# Altium schematic sheet TK2560_InputKeys.SchDoc
size A4
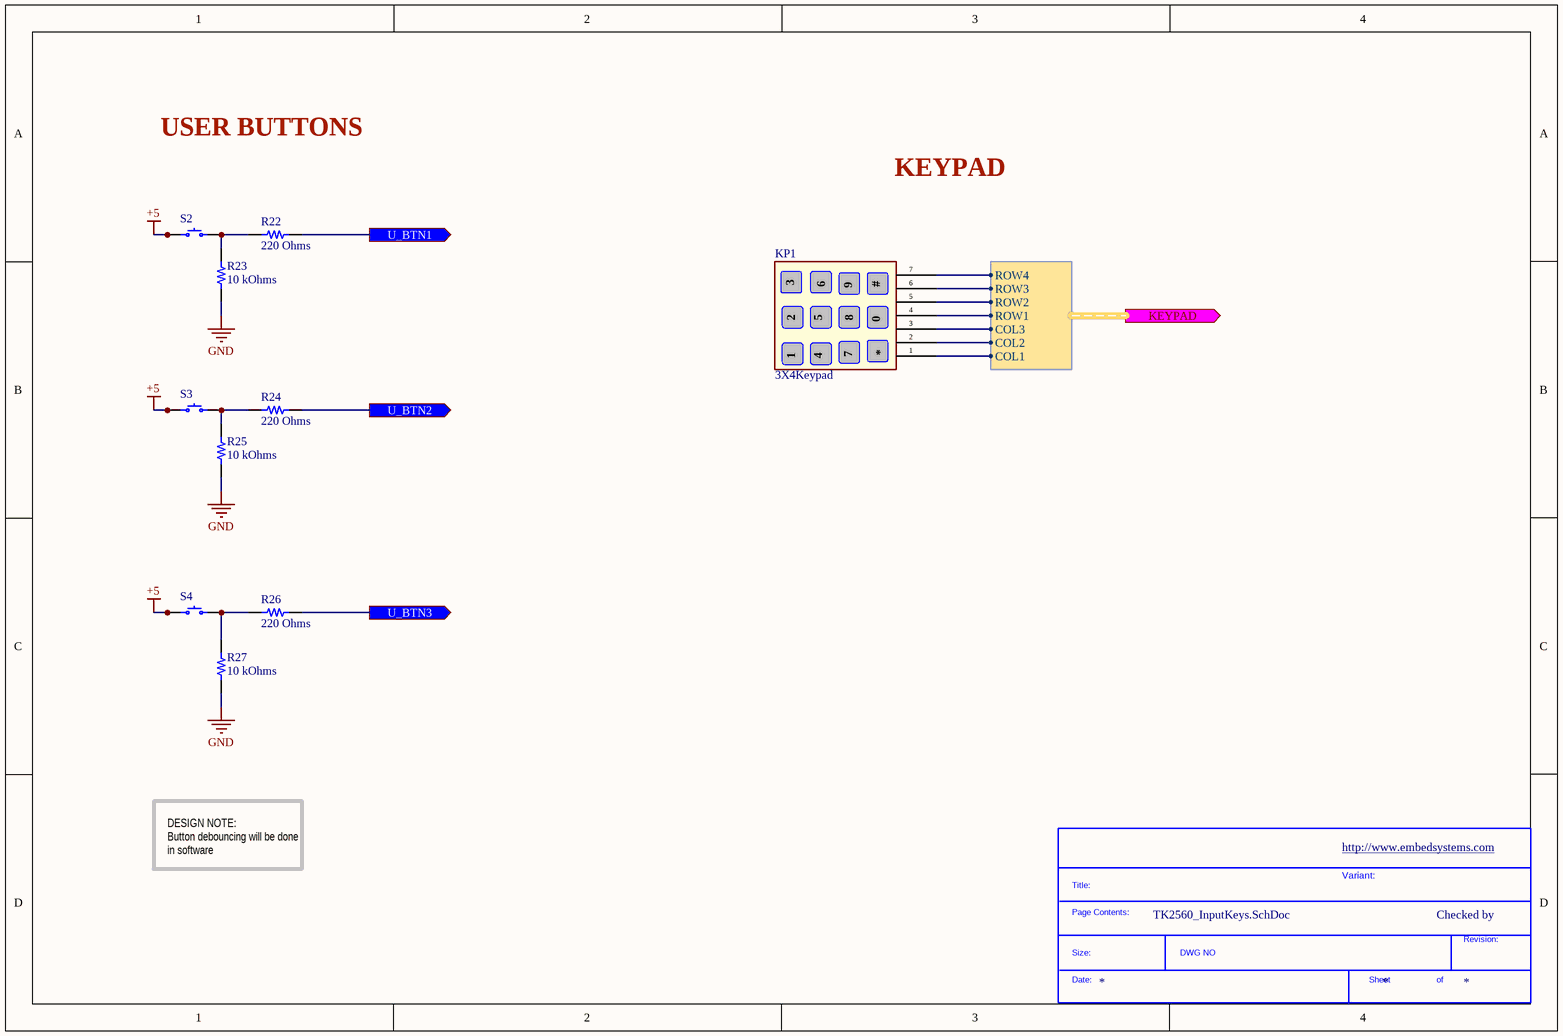
[diagram p0: TK2560_InputKeys.SchDoc]

## Parts
*?  SDTitleBlock  (value not drawn)  (graphical)
KP1  3X4Keypad  [COM-08653]
R22  220 Ohms  [RES 0805_2012]
R23  10 kOhms  [RES 0805_2012]
R24  220 Ohms  [RES 0805_2012]
R25  10 kOhms  [RES 0805_2012]
R26  220 Ohms  [RES 0805_2012]
R27  10 kOhms  [RES 0805_2012]
S2  PTS645SM43SMTR92 LFS  [C&K PTS645]  (value not drawn)
S3  PTS645SM43SMTR92 LFS  [C&K PTS645]  (value not drawn)
S4  PTS645SM43SMTR92 LFS  [C&K PTS645]  (value not drawn)

## Ports
KEYPAD (out, harness KEYPAD), U_BTN1 (out), U_BTN2 (out), U_BTN3 (out)

## Harnesses
KEYPAD: ROW1, ROW2, ROW3, ROW4, COL1, COL2, COL3

## Nets
+5: S2.1 S2.2 S3.1 S3.2 S4.1 S4.2
GND: R23.2 R25.2 R27.2
U_BTN1: R22.2 ; port U_BTN1
U_BTN2: R24.2 ; port U_BTN2
U_BTN3: R26.2 ; port U_BTN3
NetKP1_1: KP1.1 ; port KEYPAD.COL1
NetKP1_2: KP1.2 ; port KEYPAD.COL2
NetKP1_3: KP1.3 ; port KEYPAD.COL3
NetKP1_4: KP1.4 ; port KEYPAD.ROW1
NetKP1_5: KP1.5 ; port KEYPAD.ROW2
NetKP1_6: KP1.6 ; port KEYPAD.ROW3
NetKP1_7: KP1.7 ; port KEYPAD.ROW4
NetR22_1: R22.1 R23.1 S2.3 S2.4
NetR24_1: R24.1 R25.1 S3.3 S3.4
NetR26_1: R26.1 R27.1 S4.3 S4.4

## Notes on the sheet
- USER BUTTONS
- KEYPAD
- DESIGN NOTE:
  Button debouncing will be done in software
- http://www.embedsystems.com
- Variant:
- Checked by
- (in symbol 3X4Keypad) 9; #; 8; 0
- (in symbol SDTitleBlock) Title:; Page Contents:; Revision:; Size:; DWG NO; Date:; Sheet; of

## Library data of the parts
KP1 = 3X4Keypad: 3x4 Matrix Keypad; Manufacturer: Adafruit Industries; Manufacturer Part Number: 3845; Stock 1: 43; Pricing 1: 1=6.50000 (USD); Supplier 1: Digi-Key; Supplier Part Number 1: 1528-2673-ND
R22 R24 R26 = ERJ-6ENF2200V: RES SMD 220 OHM 1% 1/8W 0805; Manufacturer: Panasonic Electronic Components; Power (Watts): 0.125W, 1/8W; Temperature Coefficient: ±100ppm/°C; Part Number: ERJ-6ENF2200V; Value: 220 Ohms; ComponentLink1Description: Datasheet; ComponentLink1URL: https://industrial.panasonic.com/cdbs/www-data/pdf/RDA0000/AOA0000C304.pdf; ComponentLink2Description: DigiKey Link; ComponentLink2URL: http://digikey.com/product-detail/en/panasonic-electronic-components/ERJ-6ENF2200V/P220CCT-ND/1746831; Composition: Thick Film; Device Package: 0805 (2012 Metric); Features: Automotive AEC-Q200; Height - Seated (Max): 0.028" (0.70mm); LastUpdated: 02/09/2020 01:15:19; Lifecycle Status: Active; Minimum Order: 1; Number of Terminations: 2; Operating Temperature: -55°C ~ 155°C; Package / Case: 0805 (2012 Metric); Packaging: TapeAndReel; PartId: 30101; Part Status: Active; Price: 0.01; Ratings: AEC-Q200; Resistance: 220 Ohms; Series: ERJ; Size / Dimension: 0.079" L x 0.049" W (2.00mm x 1.25mm); Supplier 1: DigiKey; Supplier Part Number 1: P220CCT-ND; Supplier Device Package: 0805; Tolerance: ±1%
R23 R25 R27 = CPF0805B10KE: RES SMD 10K OHM 0.1% 1/10W 0805; Manufacturer: TE Connectivity Passive Product; Power (Watts): 0.1W, 1/10W; Temperature Coefficient: ±25ppm/°C; Part Number: CPF0805B10KE; Value: 10 kOhms; ComponentLink1Description: Datasheet; ComponentLink1URL: https://www.te.com/commerce/DocumentDelivery/DDEController?Action=srchrtrv&DocNm=1773200&DocType=DS&DocLang=English; ComponentLink2Description: DigiKey Link; ComponentLink2URL: http://digikey.com/product-detail/en/te-connectivity-passive-product/CPF0805B10KE/A106043CT-ND/3477679; Composition: Thin Film; Device Package: 0805 (2012 Metric); Height - Seated (Max): 0.026" (0.65mm); LastUpdated: 02/09/2020 01:15:24; Lifecycle Status: Active; Minimum Order: 1; Number of Terminations: 2; Operating Temperature: -55°C ~ 155°C; Package / Case: 0805 (2012 Metric); Packaging: TapeAndReel; PartId: 27724; Part Status: Active; Price: 0.09; Resistance: 10 kOhms; Series: CPF, Neohm; Size / Dimension: 0.079" L x 0.049" W (2.00mm x 1.25mm); Supplier 1: DigiKey; Supplier Part Number 1: A106043CT-ND; Supplier Device Package: 0805; Tolerance: ±0.1%
S2-S4 = PTS645SM43SMTR92 LFS: SWITCH TACTILE SPST-NO 0.05A 12V; Manufacturer: C&K; Actuator Height off PCB, Vertical: 4.30mm; Actuator Orientation: Top Actuated; Actuator Type: Standard; Contact Rating @ Voltage: 0.05A @ 12VDC; Illumination: Non-Illuminated; Operating Force: 160gf; Outline: 6.00mm x 6.00mm; Switch Function: Off-Mom; Part Number: PTS645SM43SMTR92 LFS; Circuit: SPST-NO; ComponentLink1Description: Datasheet; ComponentLink1URL: https://dznh3ojzb2azq.cloudfront.net/products/Tactile/PTS645/documents/datasheet.pdf; ComponentLink2Description: DigiKey Link; ComponentLink2URL: http://digikey.com/product-detail/en/c-k/PTS645SM43SMTR92-LFS/CKN9112CT-ND/1146934; Features: Blue Actuator; LastUpdated: 09/04/2020 09:59:00; Lifecycle Status: Active; Minimum Order: 1; Mounting Type: Surface Mount; Operating Temperature: -20°C ~ 60°C; Packaging: TapeAndReel; Part Status: Active; Price: 0.09; Series: PTS645; Supplier 1: DigiKey; Supplier Part Number 1: CKN9112CT-ND; Termination Style: Gull Wing